# Altium schematic sheet DIGITAL_INPUT.SchDoc
size A
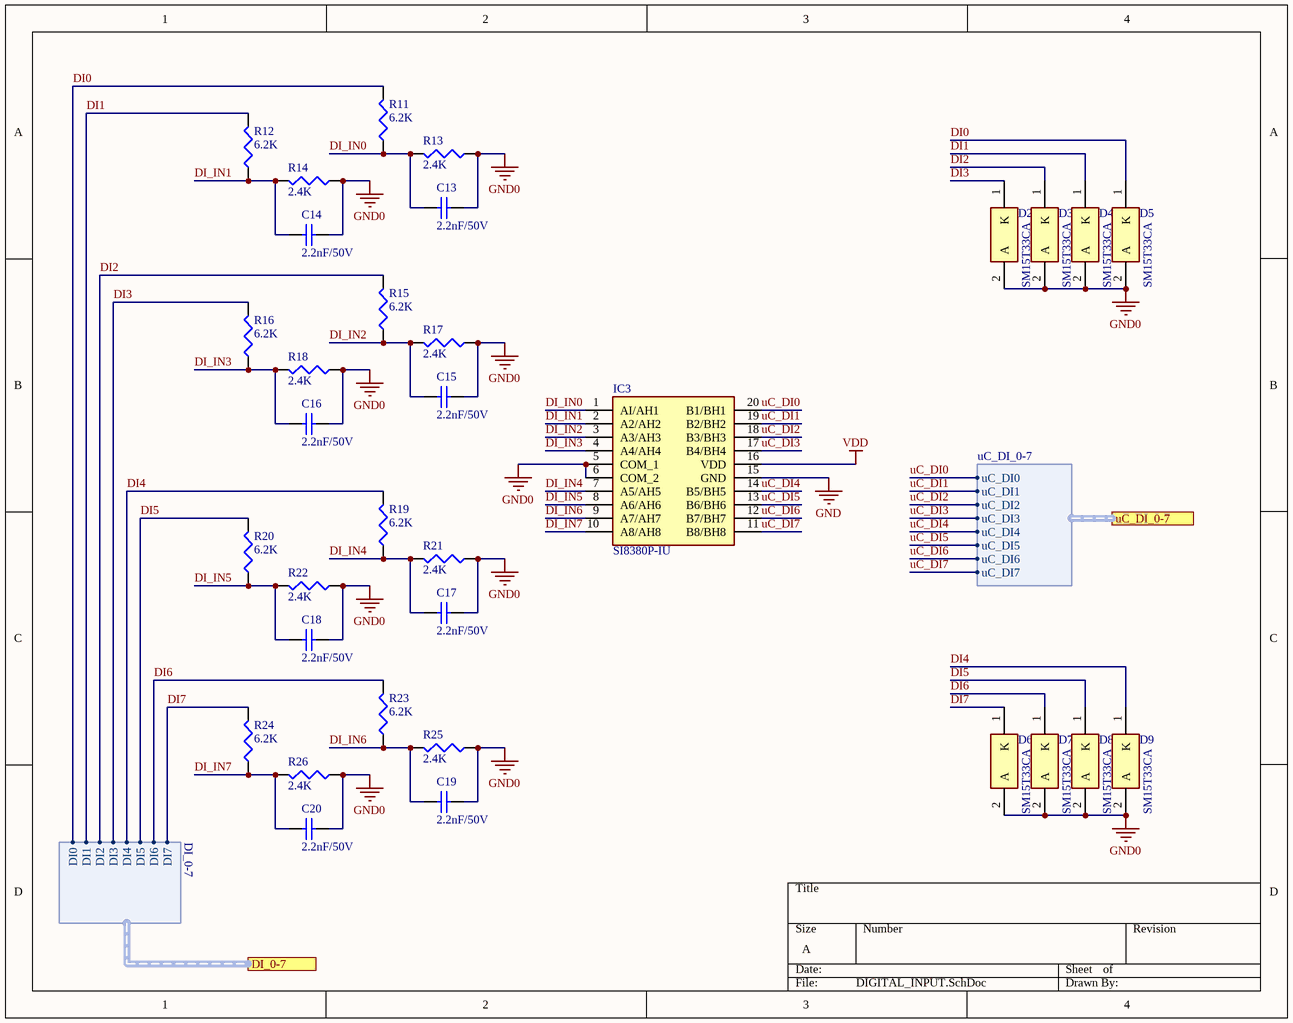
[diagram p0: DIGITAL_INPUT.SchDoc]

## Parts
C13  2.2nF/50V  [C1210]
C14  2.2nF/50V  [C1210]
C15  2.2nF/50V  [C1210]
C16  2.2nF/50V  [C1210]
C17  2.2nF/50V  [C1210]
C18  2.2nF/50V  [C1210]
C19  2.2nF/50V  [C1210]
C20  2.2nF/50V  [C1210]
D2  SM15T33CA  [DIONM8059X265N]
D3  SM15T33CA  [DIONM8059X265N]
D4  SM15T33CA  [DIONM8059X265N]
D5  SM15T33CA  [DIONM8059X265N]
D6  SM15T33CA  [DIONM8059X265N]
D7  SM15T33CA  [DIONM8059X265N]
D8  SM15T33CA  [DIONM8059X265N]
D9  SM15T33CA  [DIONM8059X265N]
IC3  SI8380P-IU  [SOP64P600X175-20N]
R11  6.2K  [12Z-2010]
R12  6.2K  [12Z-2010]
R13  2.4K  [12Z-2010]
R14  2.4K  [12Z-2010]
R15  6.2K  [12Z-2010]
R16  6.2K  [12Z-2010]
R17  2.4K  [12Z-2010]
R18  2.4K  [12Z-2010]
R19  6.2K  [12Z-2010]
R20  6.2K  [12Z-2010]
R21  2.4K  [12Z-2010]
R22  2.4K  [12Z-2010]
R23  6.2K  [12Z-2010]
R24  6.2K  [12Z-2010]
R25  2.4K  [12Z-2010]
R26  2.4K  [12Z-2010]

## Ports
DI_0-7 (harness DI_0-7), uC_DI_0-7 (harness uC_DI_0-7)

## Harnesses
DI_0-7: DI0, DI1, DI2, DI3, DI4, DI5, DI6, DI7
uC_DI_0-7: uC_DI0, uC_DI1, uC_DI2, uC_DI3, uC_DI4, uC_DI5, uC_DI6, uC_DI7

## Nets
GND: IC3.15(GND)
GND0: C13.2 C14.2 C15.2 C16.2 C17.2 C18.2 C19.2 C20.2 D2.2(A) D3.2(A) D4.2(A) D5.2(A) D6.2(A) D7.2(A) D8.2(A) D9.2(A) IC3.5(COM_1) IC3.6(COM_2) R13.1 R14.1 R17.1 R18.1 R21.1 R22.1 R25.1 R26.1
VDD: IC3.16(VDD)
DI0: D5.1(K) R11.2 ; port DI_0-7.DI0
DI1: D4.1(K) R12.2 ; port DI_0-7.DI1
DI2: D3.1(K) R15.2 ; port DI_0-7.DI2
DI3: D2.1(K) R16.2 ; port DI_0-7.DI3
DI4: D9.1(K) R19.2 ; port DI_0-7.DI4
DI5: D8.1(K) R20.2 ; port DI_0-7.DI5
DI6: D7.1(K) R23.2 ; port DI_0-7.DI6
DI7: D6.1(K) R24.2 ; port DI_0-7.DI7
DI_IN0: C13.1 IC3.1(AI/AH1) R11.1 R13.2
DI_IN1: C14.1 IC3.2(A2/AH2) R12.1 R14.2
DI_IN2: C15.1 IC3.3(A3/AH3) R15.1 R17.2
DI_IN3: C16.1 IC3.4(A4/AH4) R16.1 R18.2
DI_IN4: C17.1 IC3.7(A5/AH5) R19.1 R21.2
DI_IN5: C18.1 IC3.8(A6/AH6) R20.1 R22.2
DI_IN6: C19.1 IC3.9(A7/AH7) R23.1 R25.2
DI_IN7: C20.1 IC3.10(A8/AH8) R24.1 R26.2
uC_DI0: IC3.20(B1/BH1) ; port uC_DI_0-7.uC_DI0
uC_DI1: IC3.19(B2/BH2) ; port uC_DI_0-7.uC_DI1
uC_DI2: IC3.18(B3/BH3) ; port uC_DI_0-7.uC_DI2
uC_DI3: IC3.17(B4/BH4) ; port uC_DI_0-7.uC_DI3
uC_DI4: IC3.14(B5/BH5) ; port uC_DI_0-7.uC_DI4
uC_DI5: IC3.13(B6/BH6) ; port uC_DI_0-7.uC_DI5
uC_DI6: IC3.12(B7/BH7) ; port uC_DI_0-7.uC_DI6
uC_DI7: IC3.11(B8/BH8) ; port uC_DI_0-7.uC_DI7

## Library data of the parts
C13-C20 = Cap Semi: Capacitor (Semiconductor SIM Model); Published: 8-Jun-2000; LatestRevisionDate: 29-May-2009; LatestRevisionNote: IPC-7351 Footprint Added.; PackageReference: C1206; Publisher: Altium Limited; PackageDescription: Chip Capacitor; Value: 2.2nF/50V
D2-D9 = SM15T33CA: Diode; Manufacturer_Name: STMicroelectronics; Allied_Number: 70390412; Datasheet Link: http://www.st.com/web/en/resource/technical/document/datasheet/CD00000724.pdf; Height: 2.65mm; Manufacturer_Part_Number: SM15T33CA; Mouser Part Number: 511-SM15T33CA; Mouser Price/Stock: https://www.mouser.com/Search/Refine.aspx?Keyword=511-SM15T33CA; RS Part Number: 9196428; RS Price/Stock: https://uk.rs-online.com/web/p/products/9196428; Allied Price/Stock: http://www.alliedelec.com/stmicroelectronics-sm15t33ca/70390412/
IC3 = SI8380P-IU: Integrated Circuit; Manufacturer_Name: Silicon Labs; Datasheet Link: https://componentsearchengine.com/Datasheets/1/SI8380P-IU.pdf; Height: 1.75mm; Mouser Part Number: 634-SI8380P-IU; Mouser Price/Stock: https://www.mouser.com/Search/Refine.aspx?Keyword=634-SI8380P-IU; Manufacturer_Part_Number: SI8380P-IU
R11-R26 = Res3: Resistor; Published: 8-Jun-2000; LatestRevisionDate: 29-May-2009; LatestRevisionNote: IPC-7351 Footprint Added.; PackageReference: J1-0603; Publisher: Altium Limited; PackageDescription: Chip Resistor
  R11 R12 R15 R16 R19 R23 R24: Value: 6.2K
  R13 R14 R17 R18 R21 R22 R25 R26: Value: 2.4K
  R20: Value: 6.2k